# Altium schematic sheet PWR_SRC.SchDoc
size A3
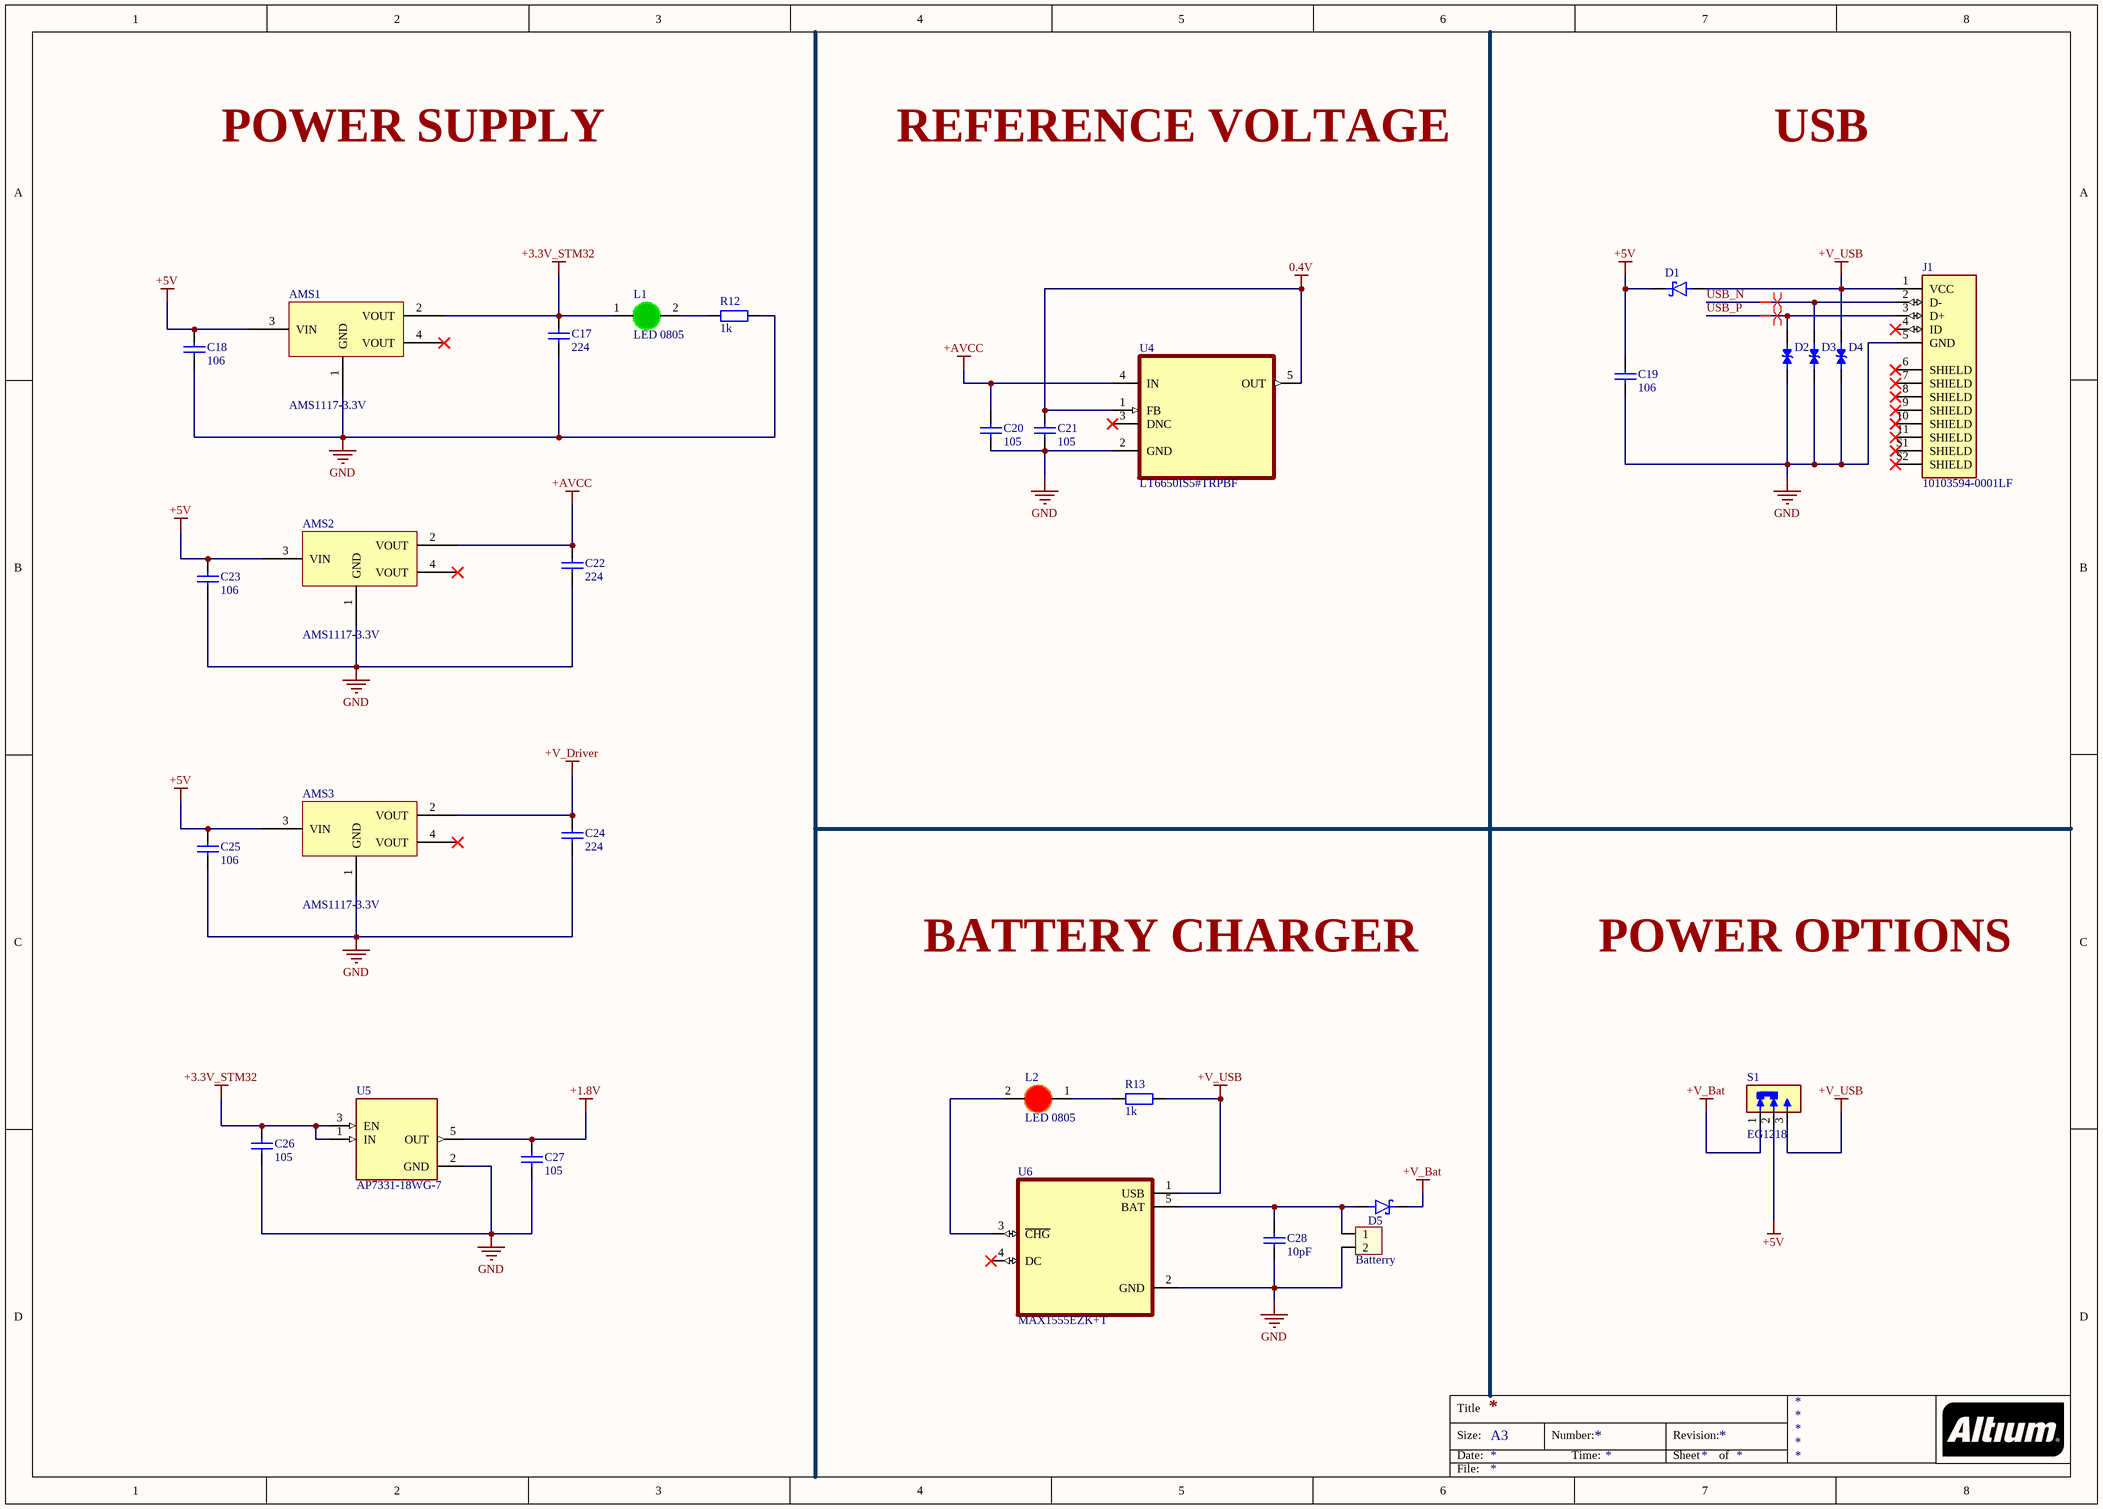
[diagram p0: PWR_SRC.SchDoc]

## Parts
AMS1  AMS1117-3.3V  [SOT223]
AMS2  AMS1117-3.3V  [SOT223]
AMS3  AMS1117-3.3V  [SOT223]
Batterry1  Batterry  [XH2.54M-2]
C17  224  [tu 0805]
C18  106  [tu 0603]
C19  106  [tu 0603]
C20  105  [tu 0603]
C21  105  [tu 0603]
C22  224  [tu 0805]
C23  106  [tu 0603]
C24  224  [tu 0805]
C25  106  [tu 0603]
C26  105  [tu 0603]
C27  105  [tu 0603]
C28  10pF  [tu 0805]
D1  1N5819HW-7-F  [SOD3715X145N]  (value not drawn)
D2  LESD5D5.0CT1G  [TVS_LESD5D5.0CT1G]  (value not drawn)
D3  LESD5D5.0CT1G  [TVS_LESD5D5.0CT1G]  (value not drawn)
D4  LESD5D5.0CT1G  [TVS_LESD5D5.0CT1G]  (value not drawn)
D5  1N5819HW-7-F  [SOD3715X145N]  (value not drawn)
J1  10103594-0001LF  [AMPHENOL_10103594-0001LF]
L1  LED 0805  [LED-0805-Green]
L2  LED 0805  [LED-0805-Red]
R12  1k  [tro smd 0603]
R13  1k  [tro smd 0603]
S1  EG1218  [SW_EG1218]
U4  LT6650IS5#TRPBF  [SOT95P280X100-5N]
U5  AP7331-18WG-7  [SOT95P285X145-5N]
U6  MAX1555EZK+T  [SOT95P275X110-5N]

## Nets
0.4V: C21.1 U4.1(FB) U4.5(OUT)
+1.8V: C27.1 U5.5(OUT)
+3.3V_STM32: AMS1.2(VOUT) C17.1 C26.1 L1.1(A) U5.1(IN) U5.3(EN)
+5V: AMS1.3(VIN) AMS2.3(VIN) AMS3.3(VIN) C18.1 C19.1 C23.1 C25.1 D1.C(K) S1.2(COM)
+AVCC: AMS2.2(VOUT) C20.1 C22.1 U4.4(IN)
+V_Bat: D5.C(K) S1.1(NC)
+V_Driver: AMS3.2(VOUT) C24.1
+V_USB: D1.A D4.2 J1.1(VCC) R13.2 S1.3(NO) U6.1(USB)
GND: AMS1.1(GND) AMS2.1(GND) AMS3.1(GND) Batterry1.2 C17.2 C18.2 C19.2 C20.2 C21.2 C22.2 C23.2 C24.2 C25.2 C26.2 C27.2 C28.2 D2.1 D3.1 D4.1 J1.5(GND) R12.2 U4.2(GND) U5.2(GND) U6.2(GND)
USB_N: D3.2 J1.2(D-)
USB_P: D2.2 J1.3(D+)
NetBatterry1_1: Batterry1.1 C28.1 D5.A U6.5(BAT)
NetL1_2: L1.2(K) R12.1
NetL2_1: L2.1(A) R13.1
NetL2_2: L2.2(K) U6.3(~{CHG})

Not connected (* = marked no-connect by the designer): AMS1 4(VOUT)*; AMS2 4(VOUT)*; AMS3 4(VOUT)*; J1 4(ID)* 6(SHIELD)* 7(SHIELD)* 8(SHIELD)* 9(SHIELD)* 10(SHIELD)* 11(SHIELD)* S1(SHIELD)* S2(SHIELD)*; U4 3(DNC)*; U6 4(DC)*

## Layout directives
differential pair; differential pair class diff90: USB_N, USB_P

## Notes on the sheet
- POWER SUPPLY
- REFERENCE VOLTAGE
- USB
- BATTERY CHARGER
- POWER OPTIONS
- Title
- Size:
- Date:
- A3
- Number:
- Time:
- Revision:
- Sheet
- of
- File:

## Library data of the parts
AMS1-AMS3 = AMS1117 SMD: Dán; Value: AMS1117-3.3V SOT223; Don_Vi: Con; Ma_Hang: MH000596; Ghi_Chu: *; Kieu_Chan: *; Chung_Loai: Dán
Batterry1 = Header 2P 2.54 Duc Thang: Cắm; Ten_Linh_Kien: Header 2P XH2.54-2P Đực Thẳng; Don_Vi: Con; Ma_Hang: MH001283; Chung_Loai: Cắm
C17 C22 C24 = Tu 0805 224 50V 10%: Dán; Don_Vi: Con; So_Chan: 2; Ten_Linh_Kien: Tụ 0805 224-0.22uF 10% 50V; Ma_Hang: MH004559; Chung_Loai: Dán; Kieu_Chan: *
C18 C19 C23 C25 = Tu 0603 106 16V 20%: Dán; Don_Vi: Con; So_Chan: 2; Ten_Linh_Kien: Tụ 0603-10uF 20% 16V; Ma_Hang: MH004848; Chung_Loai: Dán; Kieu_Chan: *
C20 C21 C26 C27 = Tu 0603 105 16V 20%: Dán; Don_Vi: Con; So_Chan: 2; Ten_Linh_Kien: Tụ 0603 105-1uF 20% 16V; Ma_Hang: MH004574; Chung_Loai: Dán; Kieu_Chan: *
C28 = Tu 0805 10pF 50V 10%: Dán; Don_Vi: Con; So_Chan: 2; Ten_Linh_Kien: Tụ 0805 10P 10% 50V; Ma_Hang: MH004554; Chung_Loai: Dán; Kieu_Chan: *
D1 D5 = 1N5819HW-7-F: 1N5819HW Series 40 V 1 A Surface Mount Schottky Barrier Rectifier - SOD-123; MF: {'manufacturer': u'Diodes Inc.'}; Package: None; Price: None; Value: *; MP: 1N5819HW-7-F; Availability: Unavailable
D2-D4 = LESD5D5.0CT1G: MF: {'manufacturer': u'Leshan Radio Co.'}; Package: None; Price: None; Value: *; MP: LESD5D5.0CT1G; Availability: Unavailable
J1 = 10103594-0001LF: USB - micro B USB 2.0 Receptacle Connector 5 Position Surface Mount, Right Angle; Through Hole; MF: {'manufacturer': u'FCI Connectors'}; Package: None; Price: None; Value: *; MP: 10103594-0001LF; Availability: Unavailable
L1 = LED 0805 Xanh La: Dán; Don_Vi: Con; Ma_Hang: MH002326; Ten_Linh_Kien: LED 0805 Màu Xanh Lá (Green); Ghi_Chu: *; Kieu_Chan: *; Chung_Loai: Dán
L2 = LED 0805 Do: Dán; Don_Vi: Con; Ma_Hang: MH000897; Ten_Linh_Kien: LED 0805 Màu Đỏ (Red); Ghi_Chu: *; Kieu_Chan: *; Chung_Loai: Dán
R12 = Tro 0603 5% 1k: Dán; Don_Vi: Con; So_Chan: 2; Ten_Linh_Kien: Trở 0603 5% 1k; Ma_Hang: MH006319; Chung_Loai: Dán; Kieu_Chan: *
R13 = Tro 0603 1% 1k: Dán; So_Chan: 2; Don_Vi: Con; Ten_Linh_Kien: Trở 0603 1% 1k; Ma_Hang: MH006334; Chung_Loai: Dán; Kieu_Chan: *
S1 = EG1218: Slide Switch, EG Series, SPDT, Non-Shorting, ON-ON, 200mA DC, 30VDC, PC Pin | E-Switch EG1218; SnapEDA_Link: https://www.snapeda.com/parts/EG1218/E-Switch/view-part/?ref=snap; Package: None; Value: *; MF: E-Switch; MP: EG1218; Check_prices: https://www.snapeda.com/parts/EG1218/E-Switch/view-part/?ref=eda
U4 = LT6650IS5#TRPBF: Micropower, 400mV Reference with Rail-to-Rail Buffer Amplifier; MF: {'manufacturer': u'Analog Devices'}; Package: None; Price: None; Value: *; MP: LT6650IS5#TRPBF; Availability: Unavailable
U5 = AP7331-18WG-7: LDO Regulator Pos 1.8V 0.3A 5-Pin SOT-25 T/R; MF: {'manufacturer': u'Diodes Inc.'}; Package: None; Price: None; Value: *; MP: AP7331-18WG-7; Availability: Unavailable
U6 = MAX1555EZK+T: MF: {'manufacturer': u'Analog Devices'}; Package: None; Price: None; Value: *; MP: MAX1555EZK+; Availability: Unavailable